# Altium schematic sheet 6-CODEC.SchDoc
size 431 x 279 mm; Organization: ORGANIZATION; Address1: ADDRESS 1; Address2: ADDRESS 2; Address3: ADDRESS 3; Address4: ADDRESS 4; DocumentNumber: 6; Revision: -; SheetNumber: 6; SheetTotal: 14; ENG_APP_DATE: --/--/--; DSN_APP_DATE: --/--/--; CHK_APP_DATE: --/--/--
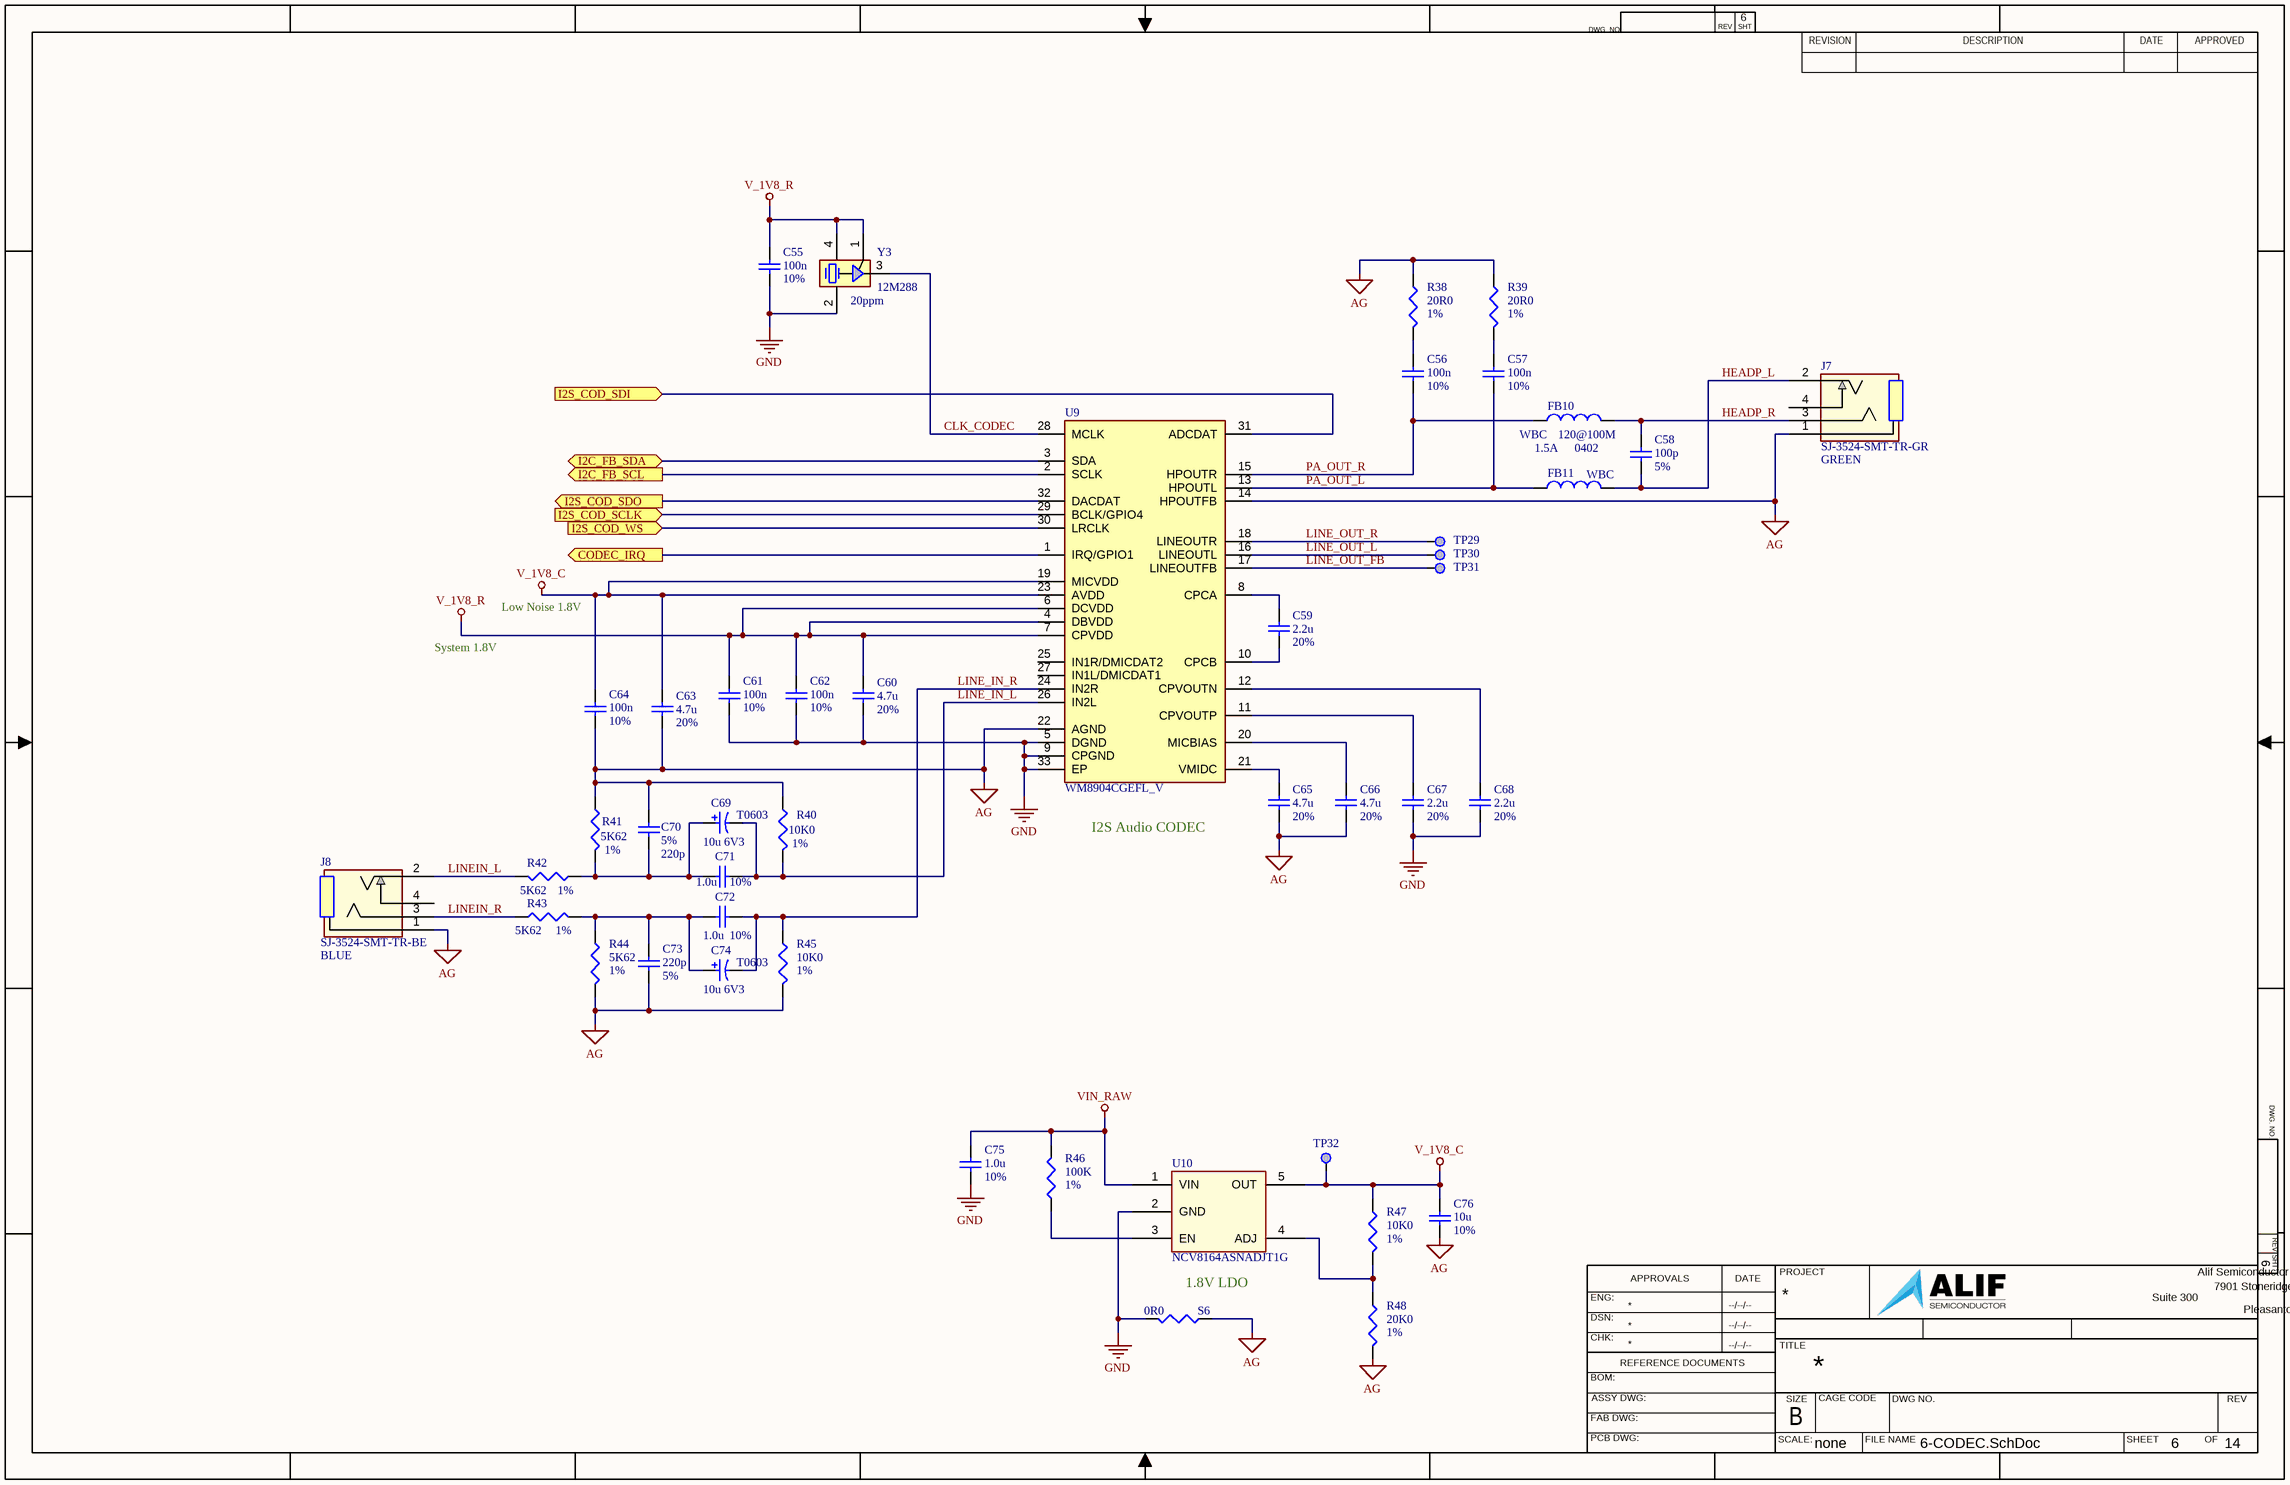
[diagram p0: 6-CODEC.SchDoc]

## Parts
C55  value 100n  Tolerance: 10%  [CAPC0402-01]  (hidden comment: Cap)
C56  value 100n  Tolerance: 10%  [CAPC0402-01]  (hidden comment: Cap)
C57  value 100n  Tolerance: 10%  [CAPC0402-01]  (hidden comment: Cap)
C58  value 100p  Tolerance: 5%  [CAPC0402-01]  (hidden comment: Cap)
C59  value 2.2u  Tolerance: 20%  [CAPC0402-01]  (hidden comment: Cap_225M25VX5R0402_1)
C60  value 4.7u  Tolerance: 20%  [CAPC0402-01]  (hidden comment: Cap)
C61  value 100n  Tolerance: 10%  [CAPC0402-01]  (hidden comment: Cap)
C62  value 100n  Tolerance: 10%  [CAPC0402-01]  (hidden comment: Cap)
C63  value 4.7u  Tolerance: 20%  [CAPC0402-01]  (hidden comment: Cap)
C64  value 100n  Tolerance: 10%  [CAPC0402-01]  (hidden comment: Cap)
C65  value 4.7u  Tolerance: 20%  [CAPC0402-01]  (hidden comment: Cap)
C66  value 4.7u  Tolerance: 20%  [CAPC0402-01]  (hidden comment: Cap)
C67  value 2.2u  Tolerance: 20%  [CAPC0402-01]  (hidden comment: Cap_225M25VX5R0402_1)
C68  value 2.2u  Tolerance: 20%  [CAPC0402-01]  (hidden comment: Cap_225M25VX5R0402_1)
C69  value 10u 6V3  Case Size/Dimension: T0603  [CAP_0603_TCS_M_ROM-L]  (hidden comment: CAP-P)
C70  value 220p  Tolerance: 5%  [CAPC0402-01]  (hidden comment: Cap)
C71  value 1.0u  Tolerance: 10%  [CAPC0402-01]  (hidden comment: Cap)
C72  value 1.0u  Tolerance: 10%  [CAPC0402-01]  (hidden comment: Cap)
C73  value 220p  Tolerance: 5%  [CAPC0402-01]  (hidden comment: Cap)
C74  value 10u 6V3  Case Size/Dimension: T0603  [CAP_0603_TCS_M_ROM-L]  (hidden comment: CAP-P)
C75  value 1.0u  Tolerance: 10%  [CAPC0402-01]  (hidden comment: Cap)
C76  value 10u  Tolerance: 10%  [CAPC0402-01]  (hidden comment: Cap)
FB10  value WBC  Impedance: 120@100M  PCB_Footprint: 0402  RMS_Current: 1.5A  [FB_0402_MuRata_as_R0402]  (hidden comment: Ind_WBC_1A5_120@100M0402_1)
FB11  value WBC  [FB_0402_MuRata_as_R0402]  (hidden comment: Ind_WBC_1A5_120@100M0402_1)
J7  SJ-3524-SMT-TR-GR  Color: GREEN  [CONN_CUI_SJ-3524-SMT-TR-XX_CUD]
J8  SJ-3524-SMT-TR-BE  Color: BLUE  [CONN_CUI_SJ-3524-SMT-TR-XX_CUD]
R38  value 20R0  Tolerance: 1%  [RESC0402-01]  (hidden comment: Res3)
R39  value 20R0  Tolerance: 1%  [RESC0402-01]  (hidden comment: Res3)
R40  value 10K0  Tolerance: 1%  [RESC0402-01]  (hidden comment: Res3)
R41  value 5K62  Tolerance: 1%  [RESC0402-01]  (hidden comment: Res3)
R42  value 5K62  Tolerance: 1%  [RESC0402-01]  (hidden comment: Res3)
R43  value 5K62  Tolerance: 1%  [RESC0402-01]  (hidden comment: Res3)
R44  value 5K62  Tolerance: 1%  [RESC0402-01]  (hidden comment: Res3)
R45  value 10K0  Tolerance: 1%  [RESC0402-01]  (hidden comment: Res3)
R46  value 100K  Tolerance: 1%  [RESC0402-01]  (hidden comment: Res3)
R47  value 10K0  Tolerance: 1%  [RESC0402-01]  (hidden comment: Res3)
R48  value 20K0  Tolerance: 1%  [RESC0402-01]  (hidden comment: Res3)
S6  value 0R0  [RESC0402-01]  (hidden comment: Res3)
TP29  TP_SMPAD  [TP_30_RND]  (value not drawn)  (no BOM)
TP30  TP_SMPAD  [TP_30_RND]  (value not drawn)  (no BOM)
TP31  TP_SMPAD  [TP_30_RND]  (value not drawn)  (no BOM)
TP32  TP_SMPAD  [TP_30_RND]  (value not drawn)  (no BOM)
U9  WM8904CGEFL_V  [QFN40P400X400X80-33N]
U10  NCV8164ASNADJT1G  [TSOT23-5_ONS]
Y3  value 12M288  Tolerance: 20ppm  [OSC_4P_3225_1210_uChip_DSC1001DL5]  (hidden comment: XO_12M288)

## Ports
CODEC_IRQ (out), I2C_FB_SCL (out), I2C_FB_SDA (bidir), I2S_COD_SCLK (in), I2S_COD_SDI (in), I2S_COD_SDO (out), I2S_COD_WS (in)

## Nets
AG: C63.1 C64.1 C65.1 C66.1 C70.1 C73.1 C76.1 J7.1 J8.1 R38.1 R39.1 R40.2 R41.2 R44.2 R45.2 R48.2 S6.1 U9.14(HPOUTFB) U9.22(AGND)
GND: C55.1 C60.1 C61.1 C62.1 C67.1 C68.1 C75.1 S6.2 U9.5(DGND) U9.9(CPGND) U9.33(EP) U10.2(GND) Y3.2(G2)
V_1V8_C: C63.2 C64.2 C76.2 R47.1 TP32.1 U9.19(MICVDD) U9.23(AVDD) U10.5(OUT)
V_1V8_R: C55.2 C60.2 C61.2 C62.2 U9.4(DBVDD) U9.6(DCVDD) U9.7(CPVDD) Y3.1(G1) Y3.4(VDD)
VIN_RAW: C75.2 R46.2 U10.1(VIN)
CLK_CODEC: U9.28(MCLK) Y3.3(OUT)
CODEC_IRQ: U9.1(IRQ/GPIO1) ; port CODEC_IRQ
HEADP_L: C58.1 FB11.2 J7.2
HEADP_R: C58.2 FB10.2 J7.3
I2C_FB_SCL: U9.2(SCLK) ; port I2C_FB_SCL
I2C_FB_SDA: U9.3(SDA) ; port I2C_FB_SDA
I2S_COD_SCLK: U9.29(BCLK/GPIO4) ; port I2S_COD_SCLK
I2S_COD_SDI: U9.31(ADCDAT) ; port I2S_COD_SDI
I2S_COD_SDO: U9.32(DACDAT) ; port I2S_COD_SDO
I2S_COD_WS: U9.30(LRCLK) ; port I2S_COD_WS
LINE_IN_L: C69.2 C71.1 R40.1 U9.26(IN2L)
LINE_IN_R: C72.1 C74.2 R45.1 U9.24(IN2R)
LINE_OUT_FB: TP31.1 U9.17(LINEOUTFB)
LINE_OUT_L: TP30.1 U9.16(LINEOUTL)
LINE_OUT_R: TP29.1 U9.18(LINEOUTR)
LINEIN_L: J8.2 R42.1
LINEIN_R: J8.3 R43.1
PA_OUT_L: C57.1 FB11.1 U9.13(HPOUTL)
PA_OUT_R: C56.1 FB10.1 U9.15(HPOUTR)
NetC56_2: C56.2 R38.2
NetC57_2: C57.2 R39.2
NetC59_1: C59.1 U9.10(CPCB)
NetC59_2: C59.2 U9.8(CPCA)
NetC65_2: C65.2 U9.21(VMIDC)
NetC66_2: C66.2 U9.20(MICBIAS)
NetC67_2: C67.2 U9.11(CPVOUTP)
NetC68_2: C68.2 U9.12(CPVOUTN)
NetC69_1: C69.1 C70.2 C71.2 R41.1 R42.2
NetC72_2: C72.2 C73.2 C74.1 R43.2 R44.1
NetR46_1: R46.1 U10.3(EN)
NetR47_2: R47.2 R48.1 U10.4(ADJ)

Not connected (* = marked no-connect by the designer): J7 4; J8 4; U9 25(IN1R/DMICDAT2) 27(IN1L/DMICDAT1)

## Notes on the sheet
- Low Noise 1.8V
- System 1.8V
- I2S Audio CODEC
- 1.8V LDO
- DWG. NO.
- REV
- SHT
- REVISION
- DESCRIPTION
- DATE
- APPROVED
- ENG:
- APPROVALS
- PROJECT
- Suite 300
- Alif Semiconductor
- 7901 Stoneridge Drive
- DSN:
- CHK:
- REFERENCE DOCUMENTS
- TITLE
- Pleasanton, CA 94588  USA
- BOM:
- FAB DWG:
- PCB DWG:
- ASSY DWG:
- SCALE:
- SIZE
- B
- CAGE CODE
- FILE NAME
- DWG NO.
- SHEET
- OF
- none

## Library data of the parts
C55-C57 C61 C62 C64 = Cap: Cap,100nF,10%,50V,X7R,0402; Manufacturer 1: TDK; Manufacturer Part Number 1: C1005X7R1H104K050BE; PCB_Footprint: CC0402; Published: 8-Jun-2000; LatestRevisionDate: 17-Jul-2002; LatestRevisionNote: Re-released for DXP Platform.; PackageReference: RAD-0.3; Publisher: Altium Limited; PackageDescription: Radial Cap, Thru-Hole; 2 Leads; 0.3 in Pin Spacing; Max_Height: 0.60mm; Manufacturer 2: Samsung; Manufacturer Part Number 2: CL05B104KB54PNC; Manufacturer 3: Walsin; Manufacturer Part Number 3: 0402B104K500CT; Type: X7R; Voltage: 50V
C58 = Cap: Cap,100pF,5%,25V,C0G,Hi-Q,0402; Manufacturer 1: Kemet; Manufacturer Part Number 1: CBR04C101J3GAC; PCB_Footprint: CC0402; Published: 8-Jun-2000; LatestRevisionDate: 17-Jul-2002; LatestRevisionNote: Re-released for DXP Platform.; PackageReference: RAD-0.3; Publisher: Altium Limited; PackageDescription: Radial Cap, Thru-Hole; 2 Leads; 0.3 in Pin Spacing; Max_Height: 0.60mm; Manufacturer 2: Kemet; Manufacturer Part Number 2: CBR04C101G3GAC; Manufacturer 3: Walsin; Manufacturer Part Number 3: RF15N101J250CT; Type: C0G; Voltage: 25V
C59 C67 C68 = Cap_225M25VX5R0402_1: Cap,2.2uF,20%,25V,X5R,0402; Manufacturer 1: TDK; Manufacturer Part Number 1: C1005X5R1E225M050BC; PCB_Footprint: CC0402; Published: 8-Jun-2000; LatestRevisionDate: 17-Jul-2002; LatestRevisionNote: Re-released for DXP Platform.; PackageReference: RAD-0.3; Publisher: Altium Limited; PackageDescription: Radial Cap, Thru-Hole; 2 Leads; 0.3 in Pin Spacing; Max_Height: 0.60mm; Type: X5R; Voltage: 25V; Manufacturer 2: Murata; Manufacturer Part Number 2: GRM155R61E225ME11D; Manufacturer 3: Murata; Manufacturer Part Number 3: GRM155R61E225ME15D
C60 C63 C65 C66 = Cap_225M25VX5R0402_1: Cap,4.7uF,20%,10V,X5R,0402; Manufacturer 1: TDK; Manufacturer Part Number 1: C1005X5R1A475K050BC; PCB_Footprint: CC0402; Published: 8-Jun-2000; LatestRevisionDate: 17-Jul-2002; LatestRevisionNote: Re-released for DXP Platform.; PackageReference: RAD-0.3; Publisher: Altium Limited; PackageDescription: Radial Cap, Thru-Hole; 2 Leads; 0.3 in Pin Spacing; Max_Height: 0.60mm; Type: X5R; Voltage: 10V; Manufacturer 2: Kyocera; Manufacturer Part Number 2: 0402YD475MAT2A; Manufacturer 3: Samsung; Manufacturer Part Number 3: CL05A475MP5NRNC
C69 C74 = CAP-P: Cap, Tant, 10uF, 6V3-10V, 10%-20%, 0603; Manufacturer 1: Kyocera; Manufacturer Part Number 1: TACL106M010XTA; Impedance: 0.03O; Ripple Current: 1650mA; Lifetime@Temperature: 4000Hrs@105degC; Type: Radial; Operating Temp Range: -40to+105degC; Manufacturer 2: Kyocera; Manufacturer Part Number 2: TACL106M010XTA; Manufacturer 3: Vishay; Manufacturer Part Number 3: 298D106X06R3M2T
C70 C73 = Cap: Cap,220pF,5%,50V,C0G,0402; Manufacturer 1: MuRata; Manufacturer Part Number 1: GRM1555C1H221JA01D; PCB_Footprint: CC0402; Published: 8-Jun-2000; LatestRevisionDate: 17-Jul-2002; LatestRevisionNote: Re-released for DXP Platform.; PackageReference: RAD-0.3; Publisher: Altium Limited; PackageDescription: Radial Cap, Thru-Hole; 2 Leads; 0.3 in Pin Spacing; Max_Height: 0.60mm; Manufacturer 2: Kemet; Manufacturer Part Number 2: C0402C221J5GACTU; Manufacturer 3: TDK; Manufacturer Part Number 3: C1005C0G1H221J050BA; Type: C0G; Voltage: 50V
C71 C72 C75 = Cap: Cap,1.0uF,20%,25V,X5R,0402; Manufacturer 1: TDK; Manufacturer Part Number 1: CGB2A1X5R1E105K033BC; PCB_Footprint: CC0402; Published: 8-Jun-2000; LatestRevisionDate: 17-Jul-2002; LatestRevisionNote: Re-released for DXP Platform.; PackageReference: RAD-0.3; Publisher: Altium Limited; PackageDescription: Radial Cap, Thru-Hole; 2 Leads; 0.3 in Pin Spacing; Max_Height: 0.60mm; Manufacturer 2: Yageo; Manufacturer Part Number 2: CC0402KRX5R8BB105; Manufacturer 3: Murata; Manufacturer Part Number 3: GRM155R61E105KA12D; Type: X5R; Voltage: 25V
C76 = Cap: Cap,10uF,20%,10V,X5R,0402; Manufacturer 1: AVX; Manufacturer Part Number 1: 0402ZD106MAT2A; PCB_Footprint: CC0402; Published: 8-Jun-2000; LatestRevisionDate: 17-Jul-2002; LatestRevisionNote: Re-released for DXP Platform.; PackageReference: RAD-0.3; Publisher: Altium Limited; PackageDescription: Radial Cap, Thru-Hole; 2 Leads; 0.3 in Pin Spacing; Max_Height: 0.60mm; Manufacturer 2: Samsung; Manufacturer Part Number 2: CL05A106MP5NUNC; Manufacturer 3: Venkel; Manufacturer Part Number 3: C0402X5R100-106MNP; Type: X5R; Voltage: 10V
FB10 = Ind_WBC_1A5_120@100M0402_1: Ind,WidebandChoke,1.5A,120ohm@100MHz,95mOhm,0402; Manufacturer 1: Murata; Manufacturer Part Number 1: BLM15EG121SN1D; Code_IEC: 1005; DCR: 143m; Tolerance: 30%; Published: 8-Jun-2000; LatestRevisionDate: 29-May-2009; LatestRevisionNote: IPC-7351 Footprint Added.; PackageReference: 0402-A; Publisher: Altium Limited; PackageDescription: Chip Inductor; Code_JEITA: 0402; Sat_Current: *; Type: *; Manufacturer 2: *; Manufacturer Part Number 2: *; Manufacturer 3: *; Manufacturer Part Number 3: *; Max_Height: 0.60mm
FB11 = Ind_WBC_1A5_120@100M0402_1: Ind,WidebandChoke,1.5A,120ohm@100MHz,95mOhm,0402; Manufacturer 1: Murata; Manufacturer Part Number 1: BLM15EG121SN1D; Code_IEC: 1005; DCR: 143m; Tolerance: 30%; PCB_Footprint: 0402; Published: 8-Jun-2000; LatestRevisionDate: 29-May-2009; LatestRevisionNote: IPC-7351 Footprint Added.; PackageReference: 0402-A; Publisher: Altium Limited; PackageDescription: Chip Inductor; Code_JEITA: 0402; Sat_Current: *; Type: *; Manufacturer 2: *; Manufacturer Part Number 2: *; Manufacturer 3: *; Manufacturer Part Number 3: *; Max_Height: 0.60mm; Impedance: 120@100M; RMS_Current: 1.5A
J7 = CONN_SJ-3524-SMT-TR-XX: Conn, Audio Jack, 3.5 mm Low Profile Surface Mount Stereo Jack, 3 Pin Right-Angle, XX = color GREEN; Mfr_Name: CUI Devices; Manufacturer 1: CUI; RefDes: RefDes; Type: Type; Manufacturer Part Number 1: SJ-3524-SMT-TR-GR; Manufacturer 2: *; Manufacturer Part Number 2: *
J8 = CONN_SJ-3524-SMT-TR-XX: Conn, Audio Jack, 3.5 mm Low Profile Surface Mount Stereo Jack, 3 Pin Right-Angle, XX = color BLUE; Mfr_Name: CUI Devices; Manufacturer 1: CUI; RefDes: RefDes; Type: Type; Manufacturer Part Number 1: SJ-3524-SMT-TR-BE; Manufacturer 2: *; Manufacturer Part Number 2: *
R38 R39 = Res3: Res,20R0,1%,100ppm,0402; Manufacturer 1: Stackpol; Manufacturer Part Number 1: RMCF0402FT20R; Wattage: 63mW; PCB_Footprint: R0402; Published: 8-Jun-2000; LatestRevisionDate: 29-May-2009; LatestRevisionNote: IPC-7351 Footprint Added.; PackageReference: RESC0402-01; Publisher: Altium Limited; PackageDescription: Chip Resistor; Voltage: *; Type: Thick Film; Manufacturer 2: Yageo; Manufacturer Part Number 2: RC0402FR-0720RL; Manufacturer 3: Bourns; Manufacturer Part Number 3: CR0402-FX-20R0GLF
R40 R45 R47 = Res3: Res,10K0,1%,100ppm,0402; Manufacturer 1: Stackpol; Manufacturer Part Number 1: RMCF0402FT10K0; Wattage: 63mW; PCB_Footprint: R0402; Published: 8-Jun-2000; LatestRevisionDate: 29-May-2009; LatestRevisionNote: IPC-7351 Footprint Added.; PackageReference: RESC0402-01; Publisher: Altium Limited; PackageDescription: Chip Resistor; Voltage: *; Type: Thick Film; Manufacturer 2: Yageo; Manufacturer Part Number 2: RC0402FR-0710KL; Manufacturer 3: Bourns; Manufacturer Part Number 3: CR0402-FX-1002GLF
R41-R44 = Res3: Res,5K62,1%,100ppm,0402; Manufacturer 1: Stackpol; Manufacturer Part Number 1: RMCF0402FT5K62; Wattage: 63mW; PCB_Footprint: R0402; Published: 8-Jun-2000; LatestRevisionDate: 29-May-2009; LatestRevisionNote: IPC-7351 Footprint Added.; PackageReference: RESC0402-01; Publisher: Altium Limited; PackageDescription: Chip Resistor; Voltage: *; Type: Thick Film; Manufacturer 2: Yageo; Manufacturer Part Number 2: RC0402FR-075K62L; Manufacturer 3: Bourns; Manufacturer Part Number 3: CR0402-FX-5621GLF
R46 = Res3: Res,100K,1%,100ppm,0402; Manufacturer 1: Stackpol; Manufacturer Part Number 1: RMCF0402FT100K; Wattage: 63mW; Published: 8-Jun-2000; LatestRevisionDate: 29-May-2009; LatestRevisionNote: IPC-7351 Footprint Added.; PackageReference: RESC0402-01; Publisher: Altium Limited; PackageDescription: Chip Resistor; Voltage: *; Type: Thick Film; Manufacturer 2: Yageo; Manufacturer Part Number 2: RC0402FR-07100KL; Manufacturer 3: Bourns; Manufacturer Part Number 3: CR0402-FX-1003GLF; PCB_Footprint: RESC0402-01
R48 = Res3: Res,20K0,1%,100ppm,0402; Manufacturer 1: Stackpol; Manufacturer Part Number 1: RMCF0402FT20K0; Wattage: 63mW; Published: 8-Jun-2000; LatestRevisionDate: 29-May-2009; LatestRevisionNote: IPC-7351 Footprint Added.; PackageReference: RESC0402-01; Publisher: Altium Limited; PackageDescription: Chip Resistor; Voltage: *; Type: Thick Film; Manufacturer 2: Yageo; Manufacturer Part Number 2: RC0402FR-0720KL; Manufacturer 3: Bourns; Manufacturer Part Number 3: CR0402-FX-2002GLF; PCB_Footprint: RESC0402-01
S6 = Res3: Res,0R ohm,Jumper,0402; Manufacturer 1: Stackpol; Manufacturer Part Number 1: RMCF0402ZT0R00; Wattage: 63mW; Tolerance: JMPR; Published: 8-Jun-2000; LatestRevisionDate: 29-May-2009; LatestRevisionNote: IPC-7351 Footprint Added.; PackageReference: RESC0402-01; Publisher: Altium Limited; PackageDescription: Chip Resistor; Voltage: *; Type: Thick Film; Manufacturer 2: Yageo; Manufacturer Part Number 2: RC0402FR-070RL; Manufacturer 3: Panasonic; Manufacturer Part Number 3: ERJ-XGN0R00Y; PCB_Footprint: RESC0402-01
TP29-TP32 = TP_SMPAD: Test Point, SMT Pad,--not a BOM item--; PCB_Footprint: TP_PAD1
U9 = IC_CODEC_WM8904CGEFL_V: IC, Audio CODEC, Ultra Low Pwr, 1.8V, QFN32; Manufacturer 1: Cirrus Logic; Manufacturer Part Number 1: WM8904CGEFL/V; Geometry.Height: 0.8mm; Mouser Part Number: 238-WM8904CGEFL/V; Mouser Price/Stock: https://www.mouser.co.uk/ProductDetail/Cirrus-Logic/WM8904CGEFL-V?qs=G8wrXCBxhFucvRVD%2FY2Zqw%3D%3D; Datasheet Link: https://statics.cirrus.com/pubs/proDatasheet/WM8904_Rev4.0.pdf
U10 = IC_LDO_NCV8164ASNADJT1G: IC, LDO,Adj 1.2V - 5.5V,300mA,SOT23-5; Manufacturer 1: OnSemi; Manufacturer Part Number 1: NCV8164ASNADJT1G
Y3 = Osc_12M288_20ppm_1V8_3225: Oscillator, XO, 12.288MHz, 20ppm, 1.8V, 2520(1008)-4P; Manufacturer 1: Epson; Manufacturer Part Number 1: SG-8101CG 12.2888M-TCHPA; PCB_Footprint: OSC1210-4P; Published: 8-Jun-2000; LatestRevisionDate: 17-Jul-2002; LatestRevisionNote: Re-released for DXP Platform.; PackageReference: *; Publisher: Altium Limited; PackageDescription: Crystal, Thru-Hole; 2 Leads; Body 3.1 x 8.2 mm (Dia.xH); Manufacturer 2: Microchip; Manufacturer Part Number 2: DSC1001DL5-012.2880; Manufacturer 3: Kyocera; Manufacturer Part Number 3: KC2520Z12.2880C1KX00